# EAGLE design Myduino-placed (EAGLE 7.6.0)
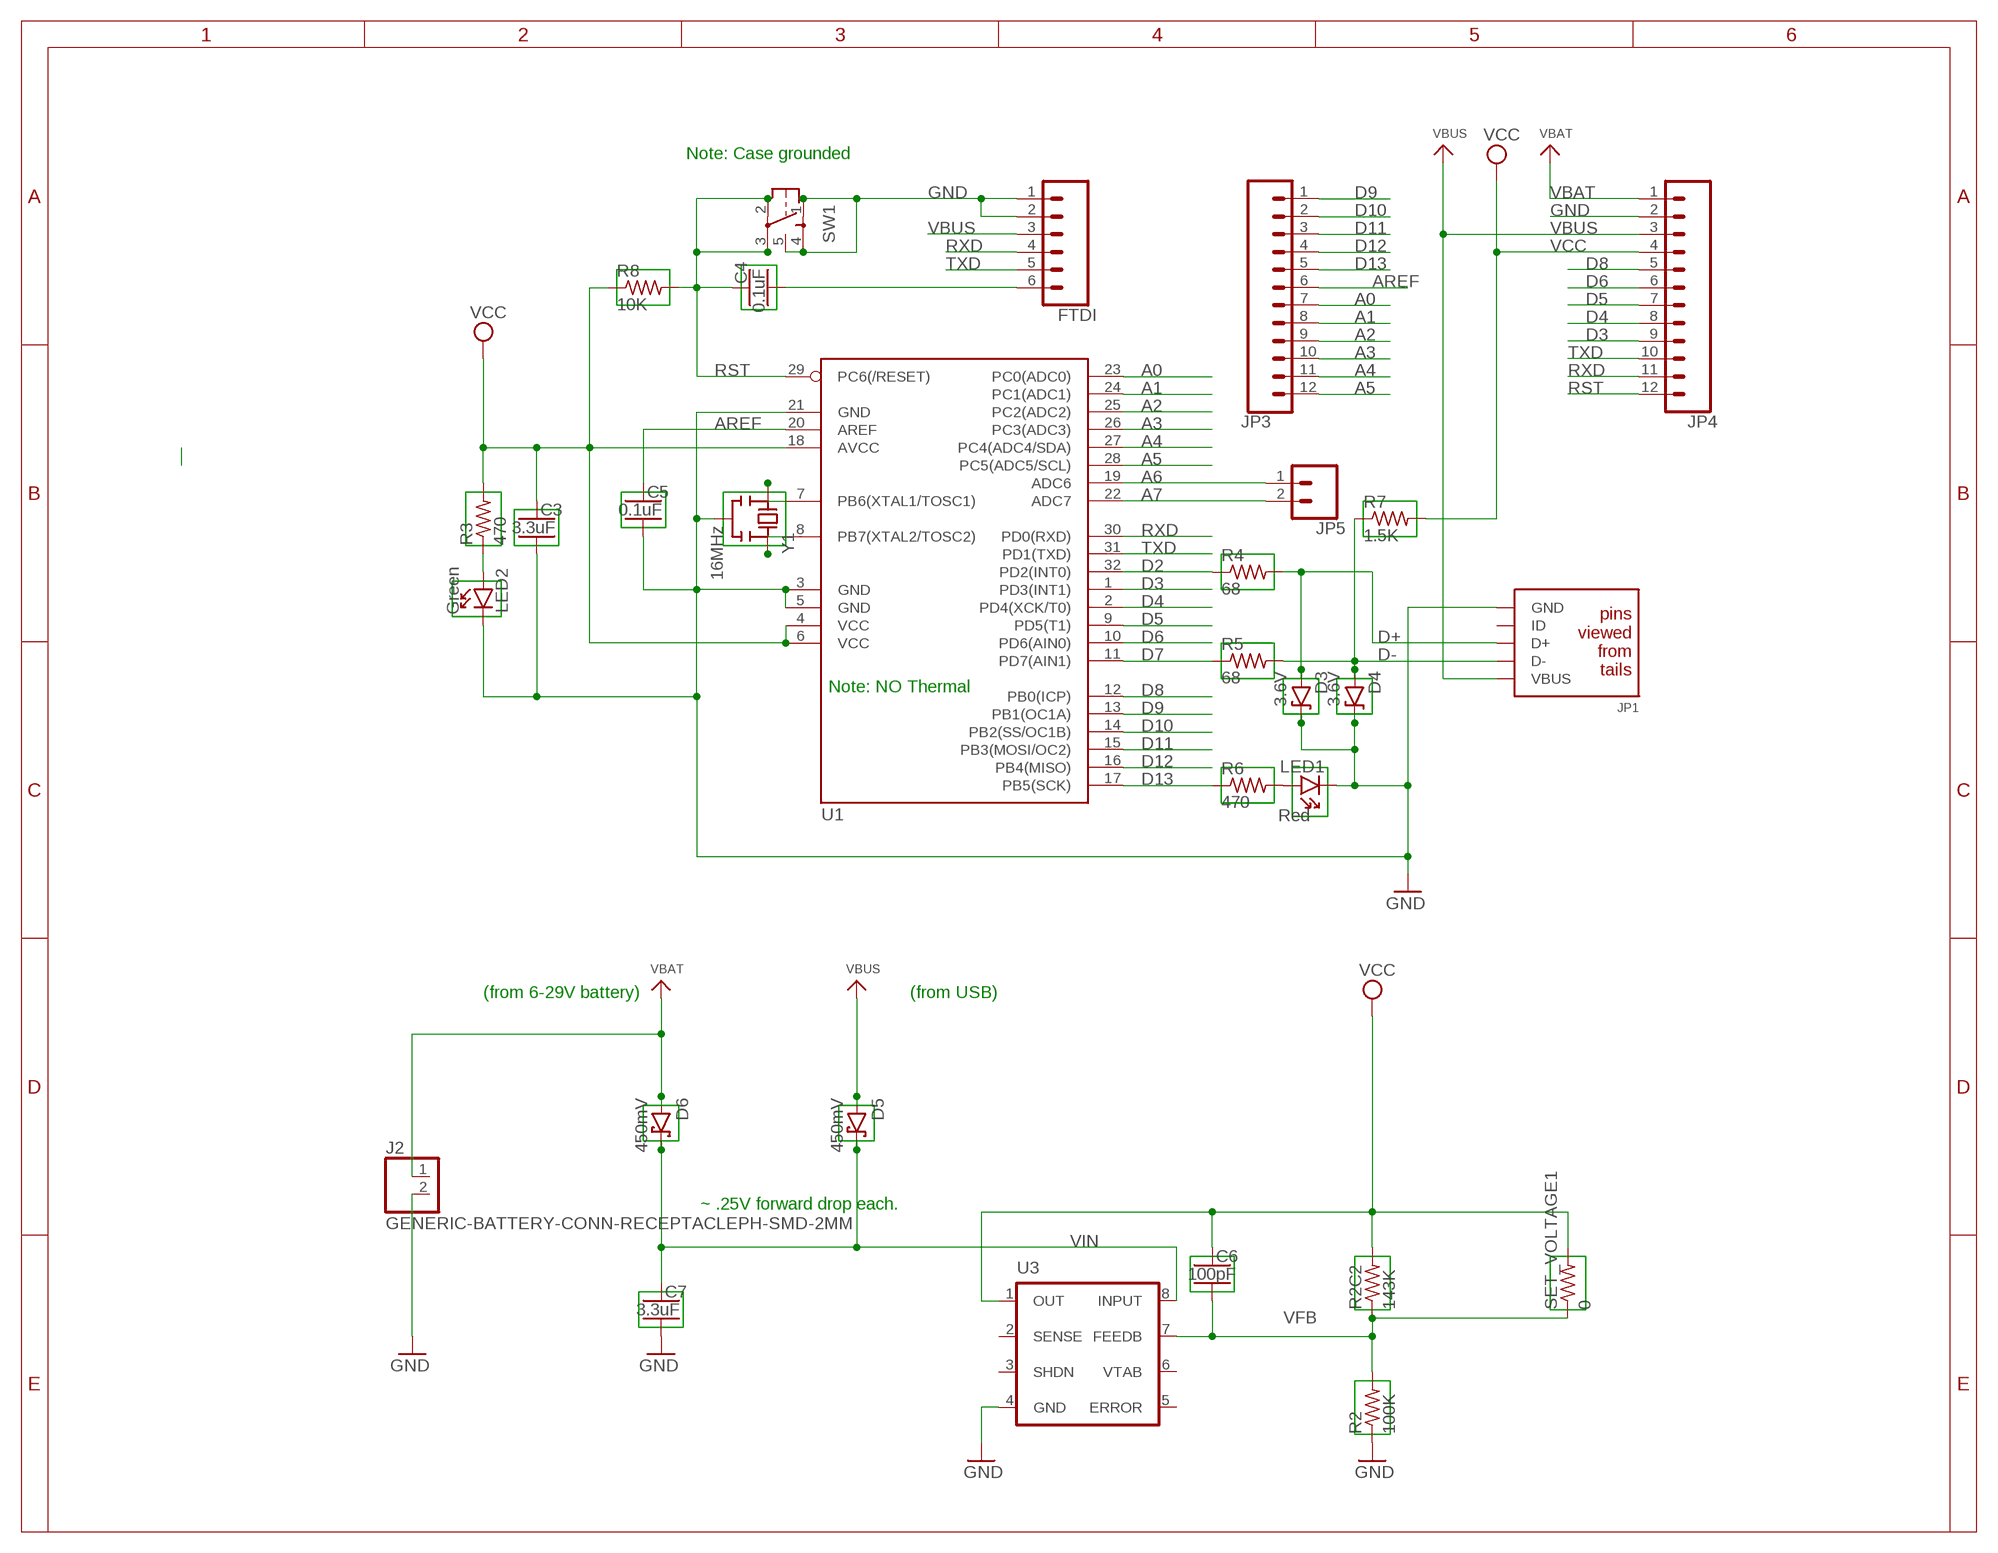
[diagram p0: schematic, sheet 1]

## Parts
C3  3.3uF  RESOLVED-CAPACITOR-NP_SMD-2012-0805_CERAMIC  [CAPC2012X140_HS]
C4  0.1uF  RESOLVED-CAPACITOR-NP_TH-FK26_CERAMIC  [CAPRB500W53L600T350H600_HS]
C5  0.1uF  RESOLVED-CAPACITOR-NP_TH-FK26_CERAMIC  [CAPRB500W53L600T350H600_HS]
C6  100pF  RESOLVED-CAPACITOR-NP_TH-FK24-FK28_CERAMIC  [CAPRB500W53L550T250H550_HS]
C7  3.3uF  RESOLVED-CAPACITOR-NP_SMD-2012-0805_CERAMIC  [CAPC2012X140_HS]
D3  3.6V  RESOLVED-DIODE-ZENER_TH-T18  [DIOAD1660W102L890D370_HS]
D4  3.6V  RESOLVED-DIODE-ZENER_TH-T18  [DIOAD1660W102L890D370_HS]
D5  450mV  RESOLVED-DIODE-SCHOTTKY_TH-DO-41-AND-DO-204AL  [DIOAD1125W78L520D270_HS]
D6  450mV  RESOLVED-DIODE-SCHOTTKY_TH-DO-41-AND-DO-204AL  [DIOAD1125W78L520D270_HS]
FTDI  SIP-6_2.54-SPACE-VERTICAL  [HDRV6W63P254_6X1_1524X254H838_HS]
J2  GENERIC-BATTERY-CONN-RECEPTACLEPH-SMD-2MM  [JST_S2B-PH-SM4-TB]
JP1  USB-5PIN-CONN_USB-MINIB-MTH-POSTS  [FCI_10033526_HS]
JP3  SIP-12_2.54-SPACE-VERTICAL  [HDRV12W63P254_12X1_3048X254H838_HS]
JP4  SIP-12_2.54-SPACE-VERTICAL  [HDRV12W63P254_12X1_3048X254H838_HS]
JP5  SIP-2_2.54-SPACE-VERTICAL  [HDRV2W63P254_2X1_508X254H838_HS]
LED1  Red  RESOLVED-DIODE-LED_TH-ROHM-4X6-ROUND  [LEDRD250W50D400H640_HS]
LED2  Green  RESOLVED-DIODE-LED_TH-ROHM-4X6-ROUND  [LEDRD250W50D400H640_HS]
R2  100K  RESOLVED-RESISTOR_TH-1/4W-CARBON  [RESAD1160W55L680D260_HS]
R2C2  143K  RESOLVED-RESISTOR_TH-1/4W-CARBON  [RESAD1160W55L680D260_HS]
R3  470  RESOLVED-RESISTOR_TH-1/6W-CARBON  [RESAD770W45L370D210_HS]
R4  68  RESOLVED-RESISTOR_TH-1/6W-CARBON  [RESAD770W45L370D210_HS]
R5  68  RESOLVED-RESISTOR_TH-1/6W-CARBON  [RESAD770W45L370D210_HS]
R6  470  RESOLVED-RESISTOR_TH-1/6W-CARBON  [RESAD770W45L370D210_HS]
R7  1.5K  RESOLVED-RESISTOR_TH-1/6W-CARBON  [RESAD770W45L370D210_HS]
R8  10K  RESOLVED-RESISTOR_TH-1/6W-CARBON  [RESAD770W45L370D210_HS]
SET_VOLTAGE1  0  RESOLVED-RESISTOR_TH-1/6W-CARBON  [RESAD770W45L370D210_HS]
SW1  PUSHBUTTON-SHIELD-GND_CK_KMR211GLSR-TACTILE  [CK_KMR211GLSR_HS]
U1  ATMEGA328-NO-THERMAL_32TQFP  [QFP80P900X900X120-32L30_HS]
U3  ADJUSTABLE-VOLTAGE-REGULATOR_SOIC8  [SOIC127P600X175-8L86_HS]
Y1  16MHz  RESOLVED-RESONATOR_TH-CTS8-X  [MURATA_CTLS8_X_SERIES_HS]

## Nets
A0: JP3.7 U1.23(PC0(ADC0))
A1: JP3.8 U1.24(PC1(ADC1))
A2: JP3.9 U1.25(PC2(ADC2))
A3: JP3.10 U1.26(PC3(ADC3))
A4: JP3.11 U1.27(PC4(ADC4/SDA))
A5: JP3.12 U1.28(PC5(ADC5/SCL))
A6: JP5.1 U1.19(ADC6)
A7: JP5.2 U1.22(ADC7)
AREF: C5.1 JP3.6 U1.20(AREF)
D2: R4.1 U1.32(PD2(INT0))
D3: JP4.9 U1.1(PD3(INT1))
D4: JP4.8 U1.2(PD4(XCK/T0))
D5: JP4.7 U1.9(PD5(T1))
D6: JP4.6 U1.10(PD6(AIN0))
D7: R5.1 U1.11(PD7(AIN1))
D8: JP4.5 U1.12(PB0(ICP))
D9: JP3.1 U1.13(PB1(OC1A))
D10: JP3.2 U1.14(PB2(SS/OC1B))
D11: JP3.3 U1.15(PB3(MOSI/OC2))
D12: JP3.4 U1.16(PB4(MISO))
D13: JP3.5 R6.1 U1.17(PB5(SCK))
D+: D3.A JP1.3(D+) R4.2
D-: D4.A JP1.2(D-) R5.2 R7.1
DTR/RTS: C4.2 FTDI.6
GND: C3.2 C5.2 C7.2 D3.C D4.C FTDI.1 FTDI.2 J2.2 JP1.5(GND) JP4.2 LED1.C LED2.C R2.1 SW1.1 SW1.4 SW1.5 U1.3(GND) U1.5(GND) U1.21(GND) U3.4(GND) Y1.2(GND)
N$2: LED1.A R6.2
N$4: U1.8(PB7(XTAL2/TOSC2)) Y1.1(OSC2)
N$5: U1.7(PB6(XTAL1/TOSC1)) Y1.3(OSC1)
N$6: LED2.A R3.1
RST: C4.1 JP4.12 R8.2 SW1.2 SW1.3 U1.29(PC6(/RESET))
RXD: FTDI.4 JP4.11 U1.30(PD0(RXD))
TXD: FTDI.5 JP4.10 U1.31(PD1(TXD))
VBAT: D6.A J2.1 JP4.1
VBUS: D5.A FTDI.3 JP1.1(VBUS) JP4.3
VCC: C3.1 C6.1 JP4.4 R2C2.2 R3.2 R7.2 R8.1 SET_VOLTAGE1.2 U1.4(VCC) U1.6(VCC) U1.18(AVCC) U3.1(OUT)
VFB: C6.2 R2.2 R2C2.1 SET_VOLTAGE1.1 U3.7(FEEDB)
VIN: C7.1 D5.C D6.C U3.8(INPUT)
Unconnected: JP1.4(ID) U3.2(SENSE) U3.3(SHDN) U3.5(ERROR) U3.6(VTAB)

## Notes on the sheet
- Note: Case grounded
- Note: NO Thermal
- (from 6-29V battery) | (from USB)
- ~ .25V forward drop each.

## Library data of the parts
C3 C7 = KoalaBuild:RESOLVED-CAPACITOR-NP_; VALUE_QUERY: 3.3uF; VOLTS: 35V; VOLTS_QUERY: 35V
C4 C5 = KoalaBuild:RESOLVED-CAPACITOR-NP_; VALUE_QUERY: 0.1uF
C6 = KoalaBuild:RESOLVED-CAPACITOR-NP_; VALUE_QUERY: 100pF
D3 D4 = KoalaBuild:RESOLVED-DIODE-ZENER_; VALUE_QUERY: 3.6
D5 D6 = KoalaBuild:RESOLVED-DIODE-SCHOTTKY_; VALUE_QUERY: <0.500V
FTDI = NVSL:SIP-6_: Generic single row in-line pin header or receptacle, 6 pin, 2.54 mm or 2mm pin spacing etc., male and female versions, shrouded or not, verticle or right angle; BREAKAWAY: 6 position; DIST1: DigiKey; DIST1PN: SAM1035-50-ND; MFR: Samtec; MPN: TSW-150-07-T-S
J2 = NVSL:GENERIC-BATTERY-CONN-RECEPTACLE; DIST1: DigiKey; DIST1PN: 455-1749-2-ND; MFR: JST; MPN: S2B-PH-SM4-TB(LF)(SN)
JP1 = NVSL:USB-5PIN-CONN_: Generic USB connector with Pwr, Gnd, D+/- and ID pins; DIST1: DigiKey; DIST1PN: 609-4701-1-ND; MFR: FCI; MPN: 10033526-N3212MLF
JP3 = NVSL:SIP-12_: Generic single row in-line pin header or receptacle, 12 pin, 2.54 mm or 2mm pin spacing etc., male and female versions, shrouded or not, verticle or right angle; BREAKAWAY: 12 position; DIST1: DigiKey; DSIST-1-PN: SAM1035-50-ND; MFR: Samtec; MPN: TSW-150-07-T-S
JP4 = NVSL:SIP-12_: Generic single row in-line pin header or receptacle, 12 pin, 2.54 mm or 2mm pin spacing etc., male and female versions, shrouded or not, verticle or right angle; BREAKAWAY: 12 position; DIST1: DigiKey; DIST1PN: SAM1035-50-ND; MFR: Samtec; MPN: TSW-150-07-T-S
JP5 = NVSL:SIP-2_: Generic single row in-line pin header or receptacle, 2 pin, 2.54 mm or 2mm pin spacing etc., male and female versions, shrouded or not, verticle or right angle; BREAKAWAY: 2 position; DIST1: DigiKey; DIST1PN: SAM1035-50-ND; MFR: Samtec; MPN: TSW-150-07-T-S
LED1 = KoalaBuild:RESOLVED-DIODE-LED_; VALUE_QUERY: Red
LED2 = KoalaBuild:RESOLVED-DIODE-LED_; VALUE_QUERY: Green
R2 = KoalaBuild:RESOLVED-RESISTOR_; TOL: 1%; TOL_QUERY: 1%; VALUE_QUERY: 100K
R2C2 = KoalaBuild:RESOLVED-RESISTOR_; TOL: 1%; TOL_QUERY: 1%; VALUE_QUERY: 143K
R3 R6 = KoalaBuild:RESOLVED-RESISTOR_; VALUE_QUERY: 470
R4 R5 = KoalaBuild:RESOLVED-RESISTOR_; VALUE_QUERY: 68
R7 = KoalaBuild:RESOLVED-RESISTOR_; VALUE_QUERY: 1.5K
R8 = KoalaBuild:RESOLVED-RESISTOR_; VALUE_QUERY: 10K
SET_VOLTAGE1 = KoalaBuild:RESOLVED-RESISTOR_; TOL: 1%; TOL_QUERY: 1%
SW1 = NVSL:PUSHBUTTON-SHIELD-GND_: Generic pushbutton switch; DIST1: DigiKey; DIST1PN: 401-1426-1-ND; MFR: C&K; MPN: KMR211GLFS
U1 = NVSL:ATMEGA328-NO-THERMAL_: ATmega328 8b microcontroller with 4,8,16,32K ISP Flash without a thermal pad underneath; DIST1: DigiKey; DIST1PN: ATMEGA328-AU-ND; MFR: Atmel; MPN: ATMEGA328-AU
U3 = NVSL:ADJUSTABLE-VOLTAGE-REGULATOR_: Generic adjustable voltage regulator using Micrel 2950/2951 series functionality; DIST1: DigiKey; DIST1PN: 576-1149-1-ND; IFWD: 150ma; MFR: Micrel; MPN: MIC2951-03YM; VFWD: 0.3V
Y1 = KoalaBuild:RESOLVED-RESONATOR_; CAP: 15pF; STBL: 0.002; VALUE_QUERY: 16 MHz

## Net classes
1 power: width 0.305 mm

## Board
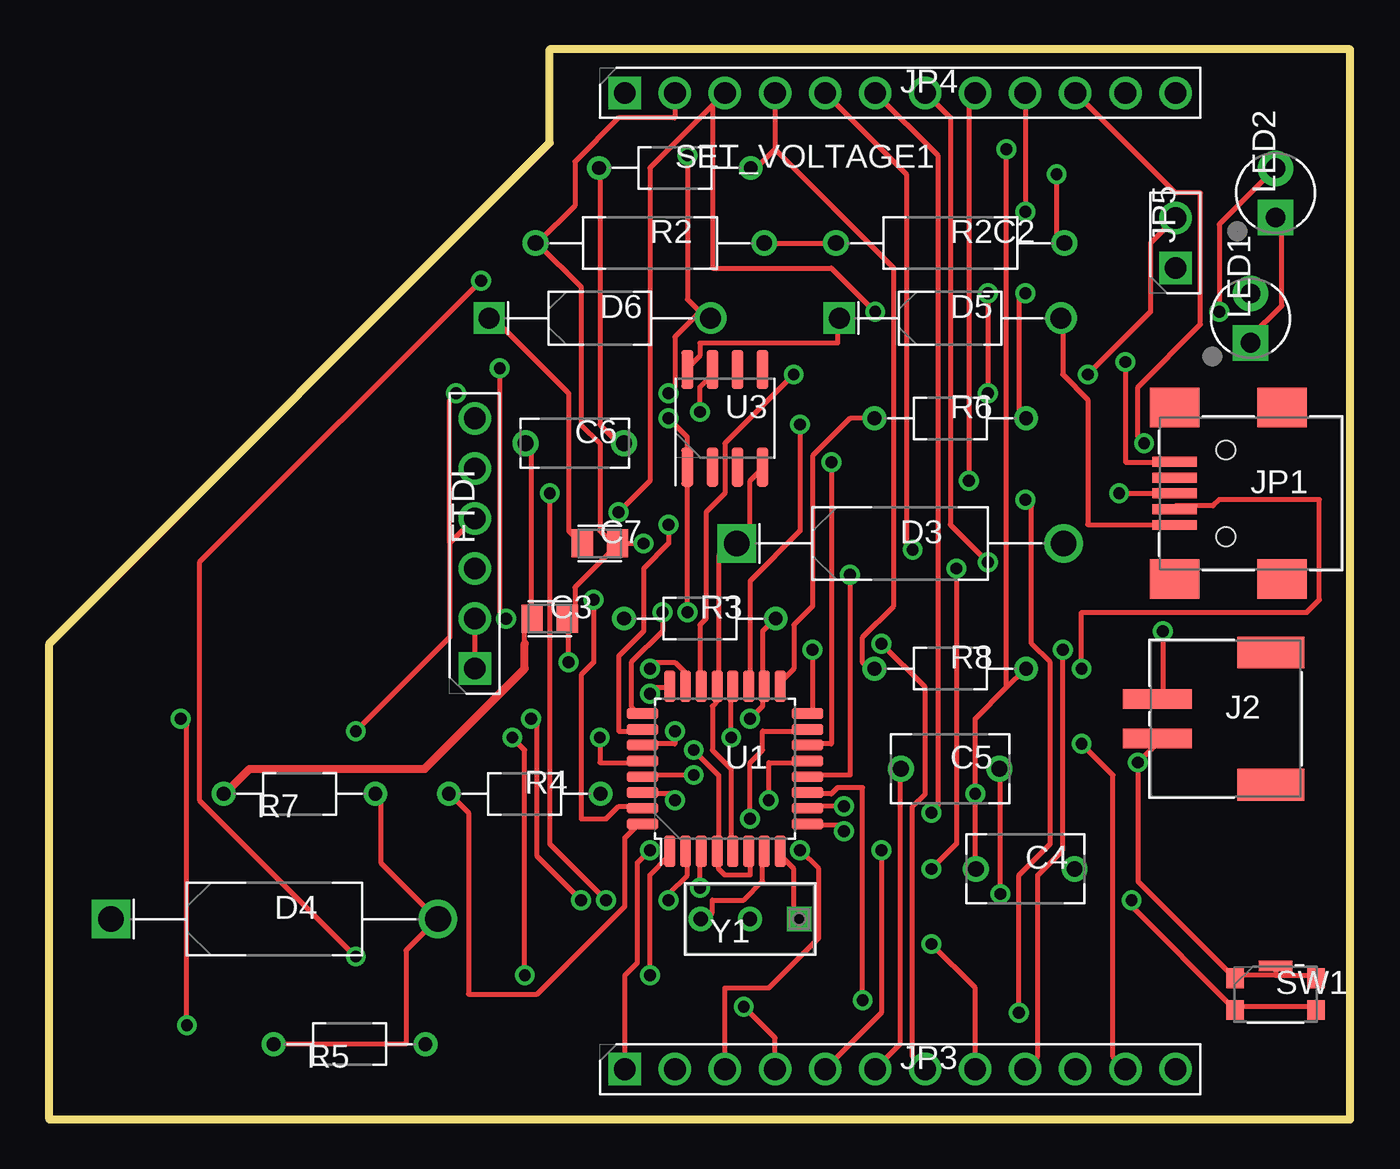
[diagram p1: board, top side]
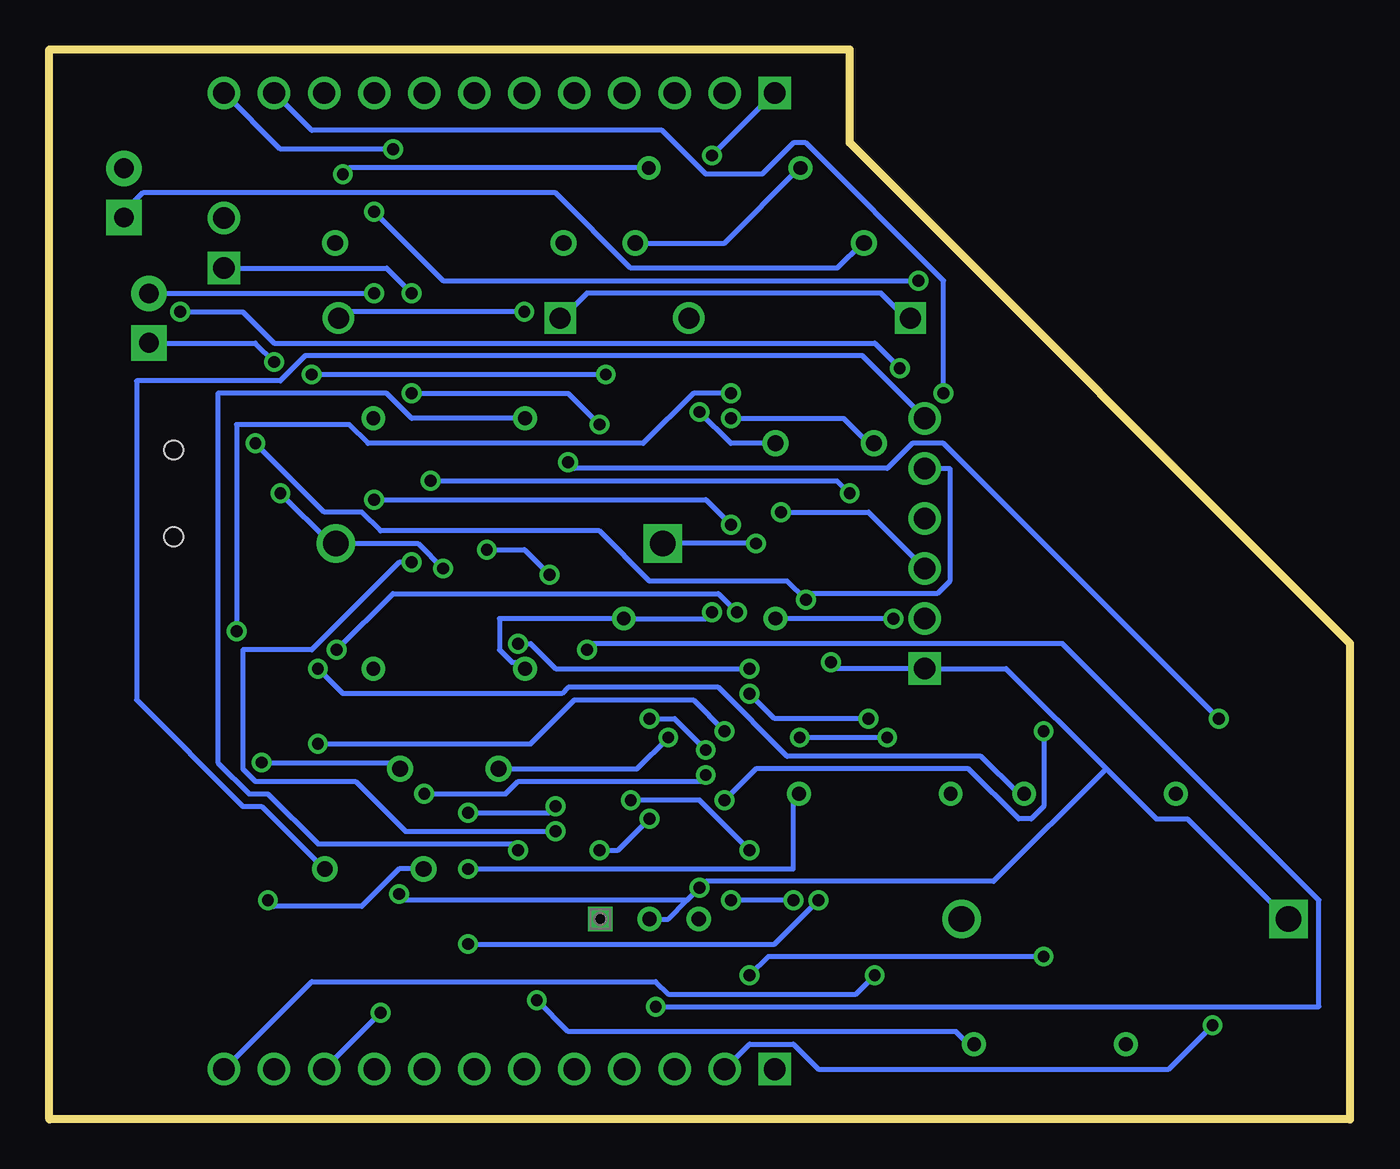
[diagram p2: board, bottom side, seen from below]

Size 66.02 x 54.28 mm. Coordinates in mm from the lower left corner, seen from the top.
Outline: 0,0 66.02,0 66.02,54.28 25.4,54.28 25.4,49.53 0,24.13 0,0
Copper layers (1*16): Top 0.035mm / dielectric 1.5mm / Bottom 0.035mm
Design rules "default": minimum track width 10mil, minimum drill 0.6mm, track to track 8mil, track to pad 8mil, pad to pad 8mil, via to via 8mil, smd to smd 8mil, copper to edge 40mil, drill to drill 8mil, minimum pad ring 10mil, minimum via ring 8mil, stop-mask expansion 4mil, vias tented up to drill 0mil, thermal gap 10mil

### Footprints (pad centres in the part's own frame; a part is rotated, then mirrored left to right if it is on the bottom)
CAPC2012X140_HS = smd 1.08 x 1.42: 1 -0.895,0; 2 0.895,0
CAPRB500W53L600T350H600_HS = drill 0.8 pad 1.2: 1 -2.5,0; 2 2.5,0
CAPRB500W53L550T250H550_HS = drill 0.8 pad 1.2: 1 -2.5,0; 2 2.5,0
DIOAD1660W102L890D370_HS = drill 1.3 pad 1.95: A 8.3,0 | drill 1.3 pad 1.95 square: C -8.3,0
DIOAD1125W78L520D270_HS = drill 1.06 pad 1.59: A 5.625,0 | drill 1.06 pad 1.59 square: C -5.625,0
HDRV6W63P254_6X1_1524X254H838_HS = drill 1.1 pad 1.65 square: 1 0,0 | drill 1.1 pad 1.65: 2 2.54,0; 3 5.08,0; 4 7.62,0; 5 10.16,0; 6 12.7,0
JST_S2B-PH-SM4-TB = smd 3.5 x 1: 1 -3.45,1; 2 -3.45,-1 | smd 3.4 x 1.6: 3 2.3,-3.35; 4 2.3,3.35
FCI_10033526_HS = smd 2.25 x 0.5: 1 -3.85,-1.6; 2 -3.85,-0.8; 3 -3.85,0; 4 -3.85,0.8; 5 -3.85,1.6 | smd 2.5 x 2: 6 -3.85,4.35; 7 1.6,4.35; 8 1.6,-4.35; 9 -3.85,-4.35 | hole 0.95: -1.25,-2.2; -1.25,2.2
HDRV12W63P254_12X1_3048X254H838_HS = drill 1.1 pad 1.65 square: 1 0,0 | drill 1.1 pad 1.65: 2 2.54,0; 3 5.08,0; 4 7.62,0; 5 10.16,0; 6 12.7,0; 7 15.24,0; 8 17.78,0; 9 20.32,0; 10 22.86,0; 11 25.4,0; 12 27.94,0
HDRV2W63P254_2X1_508X254H838_HS = drill 1.1 pad 1.65 square: 1 0,0 | drill 1.1 pad 1.65: 2 2.54,0
LEDRD250W50D400H640_HS = drill 1 pad 1.8: A 1.25,0 | drill 1 pad 1.8 square: C -1.25,0
RESAD1160W55L680D260_HS = drill 0.8 pad 1.2: 1 -5.8,0; 2 5.8,0
RESAD770W45L370D210_HS = drill 0.7 pad 1.05: 1 -3.85,0; 2 3.85,0
CK_KMR211GLSR_HS = smd 0.9 x 1: 1 -2.05,0.8; 2 -2.05,-0.8; 3 2.05,-0.8; 4 2.05,0.8 | smd 1.7 x 0.55: 5 0,1.425
QFP80P900X900X120-32L30_HS = smd 0.55 x 1.6: 1 -2.8,-4.18; 2 -2,-4.18; 3 -1.2,-4.18; 4 -0.4,-4.18; 5 0.4,-4.18; 6 1.2,-4.18; 7 2,-4.18; 8 2.8,-4.18; 17 2.8,4.18; 18 2,4.18; 19 1.2,4.18; 20 0.4,4.18; 21 -0.4,4.18; 22 -1.2,4.18; 23 -2,4.18; 24 -2.8,4.18 | smd 1.6 x 0.55: 9 4.18,-2.8; 10 4.18,-2; 11 4.18,-1.2; 12 4.18,-0.4; 13 4.18,0.4; 14 4.18,1.2; 15 4.18,2; 16 4.18,2.8; 25 -4.18,2.8; 26 -4.18,2; 27 -4.18,1.2; 28 -4.18,0.4; 29 -4.18,-0.4; 30 -4.18,-1.2; 31 -4.18,-2; 32 -4.18,-2.8
SOIC127P600X175-8L86_HS = smd 0.6 x 1.97: 1 -1.905,-2.475; 2 -0.635,-2.475; 3 0.635,-2.475; 4 1.905,-2.475; 5 1.905,2.475; 6 0.635,2.475; 7 -0.635,2.475; 8 -1.905,2.475
MURATA_CTLS8_X_SERIES_HS = drill 0.73 pad 1.1 square: 1 -2.5,0 | drill 0.73 pad 1.1: 2 0,0; 3 2.5,0

### Placement (x,y rotation side)
C3  25.4,25.4 0 top
C4  49.53,12.7 0 top
C5  45.72,17.78 0 top
C6  26.67,34.29 0 top
C7  27.94,29.21 0 top
D3  43.18,29.21 0 top
D4  11.43,10.16 0 top
D5  45.72,40.64 0 top
D6  27.94,40.64 0 top
FTDI  21.59,22.86 90 top
J2  59.69,20.32 0 top
JP1  60.96,31.75 0 top
JP3  29.21,2.54 0 top
JP4  29.21,52.07 0 top
JP5  57.15,43.18 90 top
LED1  60.96,40.64 90 top
LED2  62.23,46.99 90 top
R2  30.48,44.45 0 top
R2C2  45.72,44.45 0 top
R3  33.02,25.4 0 top
R4  24.13,16.51 0 top
R5  15.24,3.81 180 top
R6  45.72,35.56 0 top
R7  12.7,16.51 180 top
R8  45.72,22.86 0 top
SET_VOLTAGE1  31.75,48.26 0 top
SW1  62.23,6.35 0 top
U1  34.29,17.78 0 top
U3  34.29,35.56 0 top
Y1  35.56,10.16 180 top

### Tracks (layer width: path | path; a pad name or v marks a point on that pad's centre or on a via)
A0  (via drill 0.6)
  Top 0.254: v30.48,22.86 30.48,23.18 31.75,23.18 32.39,22.54 32.39,22.22 U1.23 | v42.23,24.13 44.45,21.91 44.45,16.51 43.81,15.88 43.81,3.17 JP3.7
  Bottom 0.254: v30.48,22.86 40.32,22.86 41.59,24.13 v42.23,24.13
A1  (via drill 0.6)
  Top 0.254: v30.48,21.59 30.48,21.91 31.43,21.91 U1.24 | v24.45,20.32 24.77,20 24.77,13.34 v26.99,11.11 | v44.77,8.89 46.99,6.67 JP3.8
  Bottom 0.254: v30.48,21.59 29.21,20.32 v24.45,20.32 | v26.99,11.11 29.21,8.89 v44.77,8.89
A2  (via drill 0.6)
  Top 0.254: v31.12,25.72 31.12,24.77 29.53,23.18 29.53,20.95 29.84,20.64 U1.25 | v51.44,23.81 51.44,13.65 50.17,12.38 50.17,3.17 JP3.9
  Bottom 0.254: v31.12,25.72 32.07,26.67 48.58,26.67 v51.44,23.81
A3  (via drill 0.6)
  Top 0.254: v31.43,30.16 31.43,29.21 30.16,27.94 30.16,24.77 28.89,23.49 28.89,19.68 29.84,19.68 U1.26 | v49.53,31.43 49.85,31.11 49.85,24.13 50.8,23.18 50.8,13.97 49.21,12.38 v49.21,5.4
  Bottom 0.254: v31.43,30.16 32.7,31.43 v49.53,31.43 | JP3.10 v49.21,5.4
A4  (via drill 0.6)
  Top 0.254: v31.75,19.68 31.75,19.05 30.16,19.05 U1.27 | v52.39,19.05 53.98,17.46 53.98,3.17 JP3.11
  Bottom 0.254: v31.75,19.68 33.34,21.27 39.37,21.27 41.59,19.05 v52.39,19.05
A5  (via drill 0.6)
  Top 0.254: v27.94,19.37 27.94,18.1 29.84,18.1 U1.28 | v23.5,19.37 24.13,18.73 v24.13,7.3
  Bottom 0.254: v23.5,19.37 v27.94,19.37 | v24.13,7.3 25.08,6.35 34.61,6.35 35.24,6.98 52.7,6.98 JP3.12
A6  (via drill 0.6)
  Top 0.254: v38.1,35.24 38.1,29.84 35.56,27.3 35.56,22.22 U1.19 | v47.62,41.91 v47.62,36.83
  Bottom 0.254: v38.1,35.24 39.69,36.83 v47.62,36.83 | v47.62,41.91 48.89,43.18 JP5.1
A7  (via drill 0.6)
  Top 0.254: v37.78,37.78 34.29,34.29 34.29,31.75 33.34,30.8 33.34,25.4 33.02,25.08 33.02,22.22 U1.22 | v52.7,37.78 55.88,40.96 55.88,44.45 JP5.2
  Bottom 0.254: v52.7,37.78 v37.78,37.78
AREF  (via drill 0.6)
  Top 0.254: v34.61,19.37 34.61,21.91 U1.20 | JP3.6 43.18,3.81 43.18,17.78 C5.1
  Bottom 0.254: v34.61,19.37 36.2,17.78 C5.1
D2
  Top 0.254: U1.32 29.84,14.92 29.21,14.29 29.21,10.79 24.77,6.35 21.27,6.35 21.27,15.56 20.32,16.51 R4.1
D3  (via drill 0.6)
  Top 0.254: v30.48,7.3 30.48,12.38 31.43,13.34 U1.1 | v15.56,8.25 7.62,16.19 7.62,28.26 v21.91,42.55 | JP4.9 v49.53,46.04
  Bottom 0.254: v30.48,7.3 29.53,8.25 v15.56,8.25 | v21.91,42.55 46.04,42.55 v49.53,46.04
D4  (via drill 0.6)
  Top 0.254: v31.43,11.11 31.43,11.43 32.39,12.38 32.39,13.34 U1.2 | v28.26,11.11 25.4,13.97 v25.4,31.75 | v46.67,32.38 46.67,51.75 JP4.8
  Bottom 0.254: v28.26,11.11 v31.43,11.11 | v25.4,31.75 26.03,32.38 v46.67,32.38
D5  (via drill 0.6)
  Top 0.254: v40.32,14.6 40.32,14.92 38.73,14.92 U1.9 | v47.62,28.26 45.72,30.16 45.72,50.8 JP4.7
  Bottom 0.254: v40.32,14.6 47.94,14.6 50.48,17.14 55.56,17.14 56.2,17.78 56.2,23.81 52.7,23.81 48.26,28.26 v47.62,28.26
D6  (via drill 0.6)
  Top 0.254: v40.32,15.88 38.73,15.88 U1.10 | v44.77,15.56 45.09,15.88 45.09,48.89 JP4.6
  Bottom 0.254: v40.32,15.88 40.64,15.56 v44.77,15.56
D7  (via drill 0.6)
  Top 0.254: v41.28,6.03 41.28,16.83 40.01,16.83 39.69,16.51 38.73,16.51 U1.11
  Bottom 0.254: v41.28,6.03 39.69,4.45 20,4.45 19.37,3.81 R5.1
D8  (via drill 0.6)
  Top 0.254: v40.64,27.62 40.64,17.46 38.73,17.46 U1.12 | v43.81,28.89 43.5,29.21 43.5,47.94 JP4.5
  Bottom 0.254: v40.64,27.62 41.91,28.89 v43.81,28.89
D9  (via drill 0.6)
  Top 0.254: v36.51,16.19 36.51,18.1 38.42,18.1 U1.13 | v30.48,13.65 29.84,13.02 29.84,7.94 29.21,7.3 JP3.1
  Bottom 0.254: v36.51,16.19 33.02,16.19 v30.48,13.65
D10  (via drill 0.6)
  Top 0.254: v39.69,33.34 39.69,19.05 38.73,19.05 U1.14 | v6.67,20.32 6.98,20 v6.98,4.76
  Bottom 0.254: v39.69,33.34 39.37,33.02 23.5,33.02 22.23,34.29 20.64,34.29 v6.67,20.32 | v6.98,4.76 9.21,2.54 26.99,2.54 28.26,3.81 30.48,3.81 JP3.2
D11  (via drill 0.6)
  Top 0.254: v35.56,15.24 35.56,18.1 36.2,18.73 36.2,19.68 38.42,19.68 U1.15 | v38.1,13.65 39.05,12.7 39.05,9.21 36.51,6.67 34.29,6.67 JP3.3
  Bottom 0.254: v35.56,15.24 37.15,13.65 v38.1,13.65
D12  (via drill 0.6)
  Top 0.254: v38.73,23.81 38.73,20.64 U1.16 | v35.24,5.71 36.83,4.13 JP3.4
  Bottom 0.254: v38.73,23.81 38.42,24.13 14.61,24.13 1.59,11.11 1.59,5.71 v35.24,5.71
D13  (via drill 0.6)
  Top 0.254: R6.1 40.64,35.56 38.73,33.66 38.73,26.03 37.78,25.08 37.78,22.86 37.15,22.22 U1.17 | JP3.5 42.23,5.4 v42.23,13.65
  Bottom 0.254: v42.23,13.65 42.55,13.97 52.39,13.97 54.93,16.51 55.88,16.51 57.47,18.1 57.47,36.83 48.89,36.83 47.62,35.56 R6.1
D+  (via drill 0.6)
  Top 0.254: v54.29,31.75 JP1.3 | v44.77,12.7 46.04,13.97 v46.04,27.94
  Bottom 0.254: v54.29,31.75 51.75,29.21 D3.A 47.31,29.21 v46.04,27.94 | v44.77,12.7 28.26,12.7 28.26,16.51 R4.2
D-  (via drill 0.6)
  Top 0.254: R5.2 18.1,3.81 18.1,8.57 19.69,10.16 | v52.39,22.86 52.39,25.72 63.82,25.72 64.45,26.35 64.45,31.43 59.37,31.43 59.06,31.11 57.15,31.11 JP1.2 | 19.69,10.16 16.83,13.02 16.83,16.51 R7.1 | 19.69,10.16 D4.A
  Bottom 0.254: v52.39,22.86 51.12,21.59 40.01,21.59 39.69,21.91 32.07,21.91 28.58,18.41 18.73,18.41 16.83,16.51 R7.1
DTR/RTS
  Bottom 0.254: FTDI.6 24.77,38.73 53.02,38.73 54.29,37.47 61.59,37.47 61.59,21.27 56.2,15.88 55.25,15.88 52.07,12.7 C4.2
GND  (via drill 0.6)
  Top 0.254: U1.5 34.61,13.65 34.61,17.78 33.66,18.73 33.66,20.95 33.97,21.27 33.97,21.91 U1.21 33.97,22.22 33.97,28.58 34.61,29.21 D3.C 34.92,29.21 35.56,29.84 35.56,32.38 36.2,33.02 U3.4 | v54.61,38.42 54.61,33.34 56.83,33.34 JP1.5 | LED2.C 62.23,45.72 62.55,45.4 62.55,41.27 60.96,39.69 LED1.C | 26.35,25.4 26.67,25.72 26.67,26.99 28.58,28.89 28.58,29.21 | 24.77,44.45 26.67,46.36 26.67,48.58 28.89,50.8 31.75,50.8 JP4.2 | 28.58,29.21 27.94,29.84 27.94,34.29 26.99,35.24 26.99,42.23 24.77,44.45 | 28.58,29.21 C7.2 v30.16,29.21 | 24.77,44.45 R2.1 | 62.23,7.3 60.33,7.3 SW1.1 60.01,7.3 55.25,12.06 v55.25,18.1 56.2,19.05 J2.2 | SW1.5 62.23,7.3 | 62.23,7.3 64.14,7.3 SW1.4 | v33.02,11.75 33.02,13.34 U1.3 | FTDI.2 FTDI.1 | v48.26,11.43 48.26,17.78 C5.2 | v26.35,23.18 26.35,25.4 | 26.35,25.4 C3.2
  Bottom 0.254: v54.61,38.42 55.56,39.37 60.96,39.37 LED1.C | LED2.C 62.23,46.04 61.28,46.99 40.32,46.99 36.51,43.18 26.03,43.18 24.77,44.45 R2.1 | v30.16,29.21 D3.C | v55.25,18.1 48.58,18.1 48.26,17.78 C5.2 | 33.66,11.11 34.61,10.16 Y1.2 | 33.66,11.11 v33.02,11.75 32.7,12.06 18.1,12.06 12.38,17.78 | 12.38,17.78 17.46,22.86 FTDI.1 26.03,22.86 v26.35,23.18 | 12.38,17.78 9.84,15.24 8.26,15.24 3.18,10.16 D4.C | v48.26,11.43 47.94,11.11 33.66,11.11
N$2  (via drill 0.6)
  Top 0.254: v49.53,41.91 49.21,41.59 49.21,35.88 49.53,35.56 R6.2
  Bottom 0.254: v49.53,41.91 60.96,41.91 LED1.A
N$4
  Top 0.254: U1.8 37.15,13.34 37.78,12.7 37.78,10.16 Y1.1
N$5
  Top 0.254: U1.7 36.2,13.34 36.2,12.06 35.24,11.11 33.66,11.11 33.66,10.48 33.34,10.16 Y1.3
N$6  (via drill 0.6)
  Top 0.254: v23.18,25.4 22.86,25.72 v22.86,38.1 | v59.37,40.96 59.37,45.4 62.23,48.26 LED2.A
  Bottom 0.254: v23.18,25.4 R3.1 | v22.86,38.1 24.13,39.37 54.61,39.37 56.2,40.96 v59.37,40.96
RST  (via drill 0.6)
  Top 0.254: SW1.3 64.14,5.71 60.33,5.71 SW1.2 60.01,5.71 54.93,10.79 v54.93,11.11 | v32.7,17.46 30.16,17.46 U1.29 | C4.1 46.99,12.7 v46.99,16.51 46.99,20.32 48.58,21.91 | 48.58,21.91 49.53,22.86 R8.2 | 48.58,21.91 v48.58,49.21
  Bottom 0.254: v32.7,17.46 33.02,17.14 42.23,17.14 42.86,16.51 v46.99,16.51 | v54.93,11.11 54.61,10.79 50.17,10.79 48.26,12.7 C4.1 | JP4.12 54.29,49.21 v48.58,49.21
RXD  (via drill 0.6)
  Top 0.254: v31.75,16.19 31.75,16.51 30.16,16.51 U1.30 | v15.56,19.68 20.32,24.45 20.32,29.21 | FTDI.4 20.32,29.21 | v20.64,36.83 20.32,36.51 20.32,29.21
  Bottom 0.254: v31.75,16.19 30.16,17.78 19.37,17.78 16.83,15.24 16.19,15.24 15.56,15.88 v15.56,19.68 | JP4.11 52.7,50.16 34.92,50.16 32.7,47.94 29.84,47.94 28.26,49.53 27.62,49.53 20.64,42.55 v20.64,36.83
TXD  (via drill 0.6)
  Top 0.254: v27.62,26.35 27.62,23.18 26.99,22.54 26.99,15.24 28.26,15.24 28.89,15.88 29.84,15.88 U1.31 | JP4.10 57.15,46.99 58.42,46.99 58.42,40.32 55.25,37.15 55.25,34.61 v55.56,34.29
  Bottom 0.254: FTDI.5 20.32,33.02 20.32,27.3 20.95,26.67 27.31,26.67 v27.62,26.35 28.58,27.3 35.56,27.3 38.1,29.84 49.21,29.84 50.17,30.8 52.07,30.8 v55.56,34.29
VBAT  (via drill 0.6)
  Top 0.254: 33.02,40.96 32.39,41.59 v32.39,48.89 | 33.02,40.96 33.34,40.64 D6.A 33.02,40.96 | v56.52,24.77 56.52,21.59 J2.1 | v31.43,36.83 31.75,37.15 31.75,39.69 33.02,40.96
  Bottom 0.254: JP4.1 v32.39,48.89 | v56.52,24.77 56.52,35.24 50.8,35.24 49.85,34.29 35.88,34.29 33.34,36.83 v31.43,36.83
VBUS  (via drill 0.6)
  Top 0.254: JP1.1 56.83,30.16 52.7,30.16 52.7,36.51 51.44,37.78 51.44,40.64 D5.A | v28.89,30.8 30.48,32.38 30.48,48.26 33.66,51.44 | JP4.3 33.66,51.44 | v41.91,40.96 39.69,43.18 33.66,43.18 33.66,51.44
  Bottom 0.254: FTDI.3 24.45,30.8 v28.89,30.8 | v41.91,40.96 50.8,40.96 51.12,40.64 D5.A
VCC  (via drill 0.6)
  Top 0.254: 36.83,49.21 35.88,48.26 SET_VOLTAGE1.2 | JP4.4 36.83,49.21 | v51.12,47.94 51.12,44.77 51.44,44.45 R2C2.2 | 24.45,25.4 24.13,25.08 24.13,24.13 | 24.45,25.4 24.45,34.29 C6.1 | 24.45,25.4 C3.1 | U1.6 35.56,13.34 35.56,12.38 34.29,12.38 33.97,12.7 33.97,13.34 U1.4 33.97,13.65 33.97,17.46 v32.7,18.73 | R3.2 36.83,25.4 36.2,24.77 36.2,22.22 U1.18 36.2,21.91 36.2,20.95 v35.56,20.32 | v32.39,25.72 U3.1 32.39,34.61 v31.43,35.56 | 36.83,49.21 42.86,43.18 42.86,26.03 41.28,24.45 41.28,23.18 41.59,22.86 R8.1
  Top 0.406: 24.13,24.13 24.13,22.86 19.05,17.78 10.16,17.78 8.89,16.51 R7.2
  Bottom 0.254: v51.12,47.94 50.8,48.26 SET_VOLTAGE1.2 | v32.39,25.72 32.7,25.4 R3.2 43.18,25.4 43.18,23.81 42.55,23.18 42.23,23.18 41.91,22.86 R8.1 | v32.7,18.73 34.29,20.32 v35.56,20.32 | v31.43,35.56 25.72,35.56 24.45,34.29 C6.1
VFB  (via drill 0.6)
  Top 0.254: v33.02,35.88 33.02,37.15 33.66,37.78 U3.7 | R2.2 R2C2.1 | C6.2 28.89,34.29 27.94,35.24 27.94,48.26 SET_VOLTAGE1.1
  Bottom 0.254: v33.02,35.88 31.43,34.29 C6.2 | R2.2 31.75,44.45 27.94,48.26 SET_VOLTAGE1.1
VIN
  Top 0.254: U3.8 32.39,38.1 33.02,38.73 33.02,39.37 40.01,39.37 40.01,40.64 D5.C | C7.1 26.99,29.21 26.35,29.84 26.35,36.83 22.54,40.64 D6.C
  Bottom 0.254: D5.C 40.01,40.64 38.73,41.91 23.81,41.91 22.54,40.64 D6.C